# EAGLE design Key Matrix Scanner v3 (EAGLE 9.5.1)
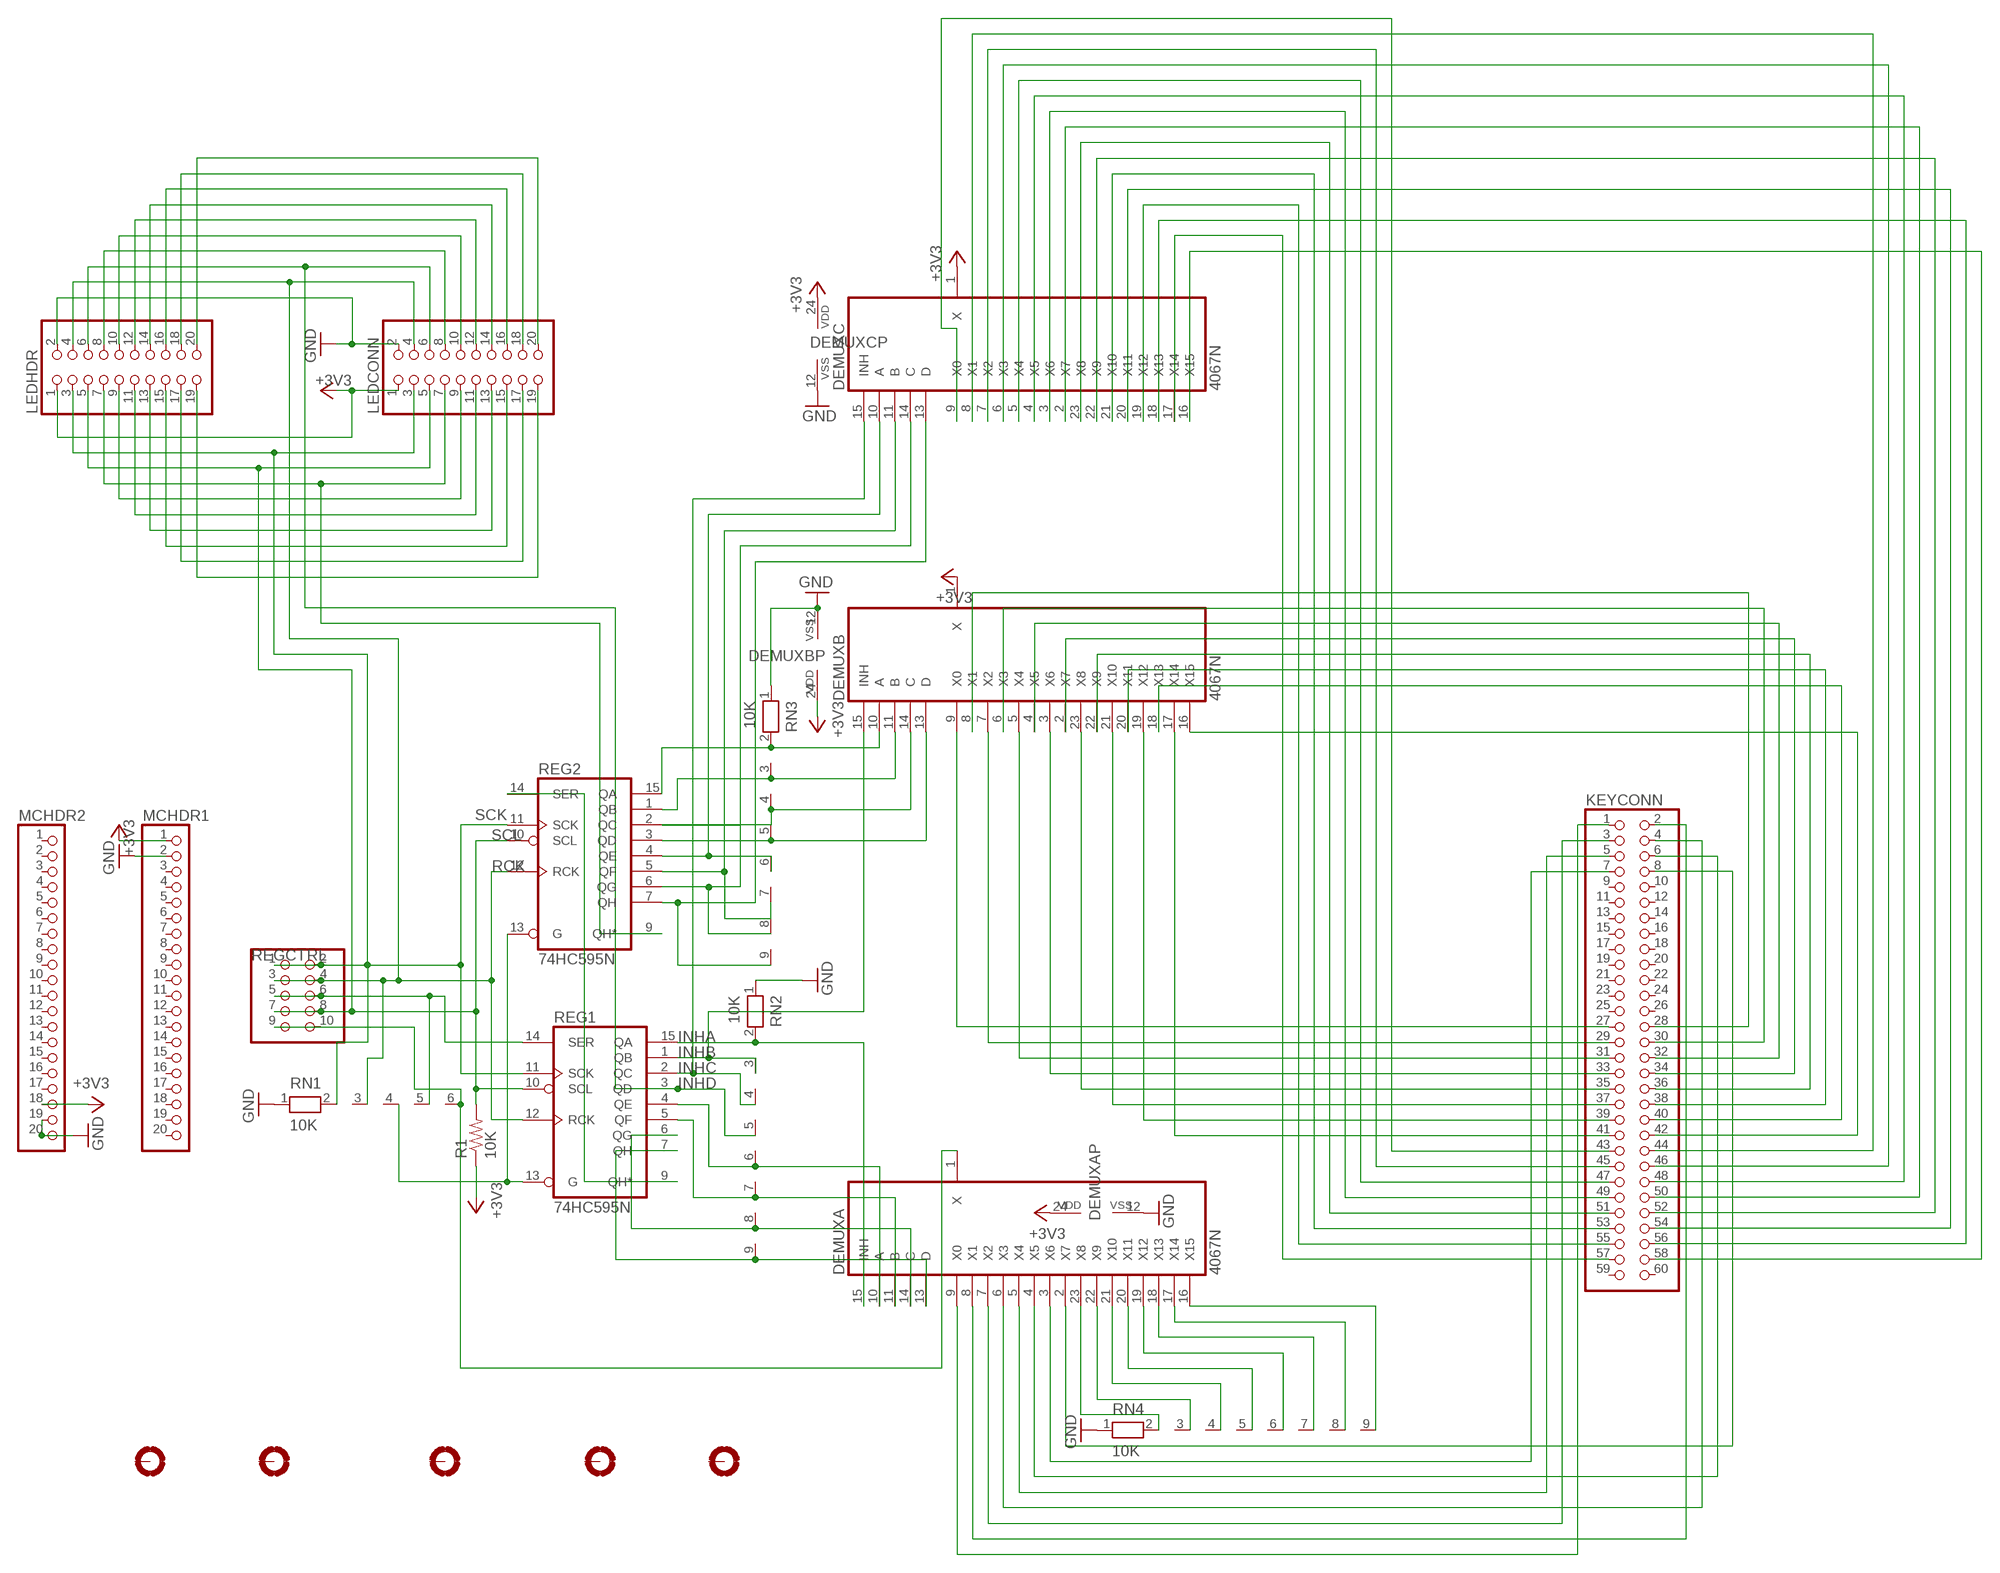
[diagram p0: schematic, sheet 1]

## Parts
DEMUXA  4067N  [DIL24-6]
DEMUXB  4067N  [DIL24-6]
DEMUXC  4067N  [DIL24-6]
H1  MOUNT-PAD-ROUND3.0  [3,0-PAD]
H2  MOUNT-PAD-ROUND3.0  [3,0-PAD]
H3  MOUNT-PAD-ROUND3.0  [3,0-PAD]
H4  MOUNT-PAD-ROUND3.0  [3,0-PAD]
H5  MOUNT-PAD-ROUND3.0  [3,0-PAD]
KEYCONN  PINHD-2X30/90  [2X30/90]
LEDCONN  PINHD-2X10  [2X10]
LEDHDR  PINHD-2X10  [2X10]
MCHDR1  PINHD-1X20  [1X20]
MCHDR2  PINHD-1X20  [1X20]
R1  10K  R-US_0204/7  [0204/7]
REG1  74HC595N  [DIL16]
REG2  74HC595N  [DIL16]
REGCTRL  PINHD-2X5  [2X05]
RN1  10K  RN05  [RN-6]
RN2  10K  RN08  [RN-9]
RN3  10K  RN08  [RN-9]
RN4  10K  RN08  [RN-9]

## Nets
+3V3: DEMUXA.24(VDD) DEMUXB.1(X) DEMUXB.24(VDD) DEMUXC.1(X) DEMUXC.24(VDD) LEDCONN.1 LEDHDR.1 MCHDR1.1 MCHDR2.18 R1.1
DATA: REG1.14(SER) REGCTRL.5 REGCTRL.6 RN1.5
GND: DEMUXA.12(VSS) DEMUXB.12(VSS) DEMUXC.12(VSS) LEDCONN.2 LEDHDR.2 MCHDR1.2 MCHDR2.19 MCHDR2.20 RN1.1 RN2.1 RN3.1 RN4.1
INHA: DEMUXA.15(INH) REG1.15(QA) RN2.2
INHB: DEMUXB.15(INH) REG1.1(QB) RN2.3
INHC: DEMUXC.15(INH) REG1.2(QC) RN2.4
INHD: LEDCONN.6 LEDHDR.6 REG1.3(QD) RN2.5
KEYREAD: DEMUXA.1(X) REGCTRL.9 REGCTRL.10 RN1.6
N$1: DEMUXC.13(D) REG2.7(QH) RN3.9
N$2: DEMUXA.9(X0) KEYCONN.1
N$3: REG1.9(QH*) REG2.14(SER)
N$4: LEDCONN.8 LEDHDR.8
N$5: LEDCONN.10 LEDHDR.10
N$6: LEDCONN.12 LEDHDR.12
N$7: LEDCONN.14 LEDHDR.14
N$8: LEDCONN.16 LEDHDR.16
N$9: LEDCONN.18 LEDHDR.18
N$10: LEDCONN.20 LEDHDR.20
N$11: DEMUXB.22(X9) KEYCONN.36
N$12: DEMUXA.8(X1) KEYCONN.2
N$13: DEMUXA.7(X2) KEYCONN.3
N$14: LEDCONN.9 LEDHDR.9
N$15: LEDCONN.11 LEDHDR.11
N$16: LEDCONN.13 LEDHDR.13
N$17: LEDCONN.15 LEDHDR.15
N$18: LEDCONN.17 LEDHDR.17
N$19: LEDCONN.19 LEDHDR.19
N$20: DEMUXC.14(C) REG2.6(QG) RN3.8
N$21: DEMUXC.11(B) REG2.5(QF) RN3.7
N$22: DEMUXC.10(A) REG2.4(QE) RN3.6
N$23: DEMUXA.6(X3) KEYCONN.4
N$24: DEMUXA.13(D) REG1.7(QH) RN2.9
N$25: DEMUXB.14(C) REG2.2(QC) RN3.4
N$26: DEMUXB.11(B) REG2.1(QB) RN3.3
N$27: DEMUXA.22(X9) RN4.3
N$28: DEMUXA.5(X4) KEYCONN.5
N$29: DEMUXA.10(A) REG1.4(QE) RN2.6
N$31: DEMUXA.21(X10) RN4.4
N$32: DEMUXA.20(X11) RN4.5
N$33: DEMUXA.4(X5) KEYCONN.6
N$34: DEMUXA.3(X6) KEYCONN.7
N$35: DEMUXA.2(X7) KEYCONN.8
N$36: DEMUXB.9(X0) KEYCONN.27
N$37: DEMUXB.8(X1) KEYCONN.28
N$38: DEMUXA.19(X12) RN4.6
N$39: DEMUXA.18(X13) RN4.7
N$40: DEMUXB.13(D) REG2.3(QD) RN3.5
N$41: DEMUXB.10(A) REG2.15(QA) RN3.2
N$42: DEMUXB.7(X2) KEYCONN.29
N$43: DEMUXB.6(X3) KEYCONN.30
N$44: DEMUXB.5(X4) KEYCONN.31
N$45: DEMUXB.4(X5) KEYCONN.32
N$46: DEMUXB.3(X6) KEYCONN.33
N$47: DEMUXB.2(X7) KEYCONN.34
N$48: DEMUXB.23(X8) KEYCONN.35
N$49: DEMUXA.14(C) REG1.6(QG) RN2.8
N$50: DEMUXB.21(X10) KEYCONN.37
N$51: DEMUXB.20(X11) KEYCONN.38
N$52: DEMUXB.19(X12) KEYCONN.39
N$53: DEMUXB.18(X13) KEYCONN.40
N$54: DEMUXB.17(X14) KEYCONN.41
N$55: DEMUXB.16(X15) KEYCONN.42
N$56: DEMUXC.9(X0) KEYCONN.43
N$57: DEMUXC.8(X1) KEYCONN.44
N$58: DEMUXC.7(X2) KEYCONN.45
N$59: DEMUXC.6(X3) KEYCONN.46
N$60: DEMUXC.5(X4) KEYCONN.47
N$61: DEMUXC.4(X5) KEYCONN.48
N$62: DEMUXC.3(X6) KEYCONN.49
N$63: DEMUXC.2(X7) KEYCONN.50
N$64: DEMUXC.23(X8) KEYCONN.51
N$65: DEMUXC.22(X9) KEYCONN.52
N$66: DEMUXC.20(X11) KEYCONN.54
N$67: DEMUXC.21(X10) KEYCONN.53
N$68: DEMUXC.19(X12) KEYCONN.55
N$69: DEMUXC.18(X13) KEYCONN.56
N$70: DEMUXC.17(X14) KEYCONN.57
N$71: DEMUXC.16(X15) KEYCONN.58
N$72: DEMUXA.17(X14) RN4.8
N$73: DEMUXA.16(X15) RN4.9
N$76: DEMUXA.11(B) REG1.5(QF) RN2.7
N$77: REG1.13(G) REG2.13(G) RN1.4
N$78: DEMUXA.23(X8) RN4.2
RCK: LEDCONN.4 LEDHDR.4 REG1.12(RCK) REG2.12(RCK) REGCTRL.3 REGCTRL.4 RN1.3
REG3DATA: LEDCONN.7 LEDHDR.7 REG2.9(QH*)
SCK: LEDCONN.3 LEDHDR.3 REG1.11(SCK) REG2.11(SCK) REGCTRL.1 REGCTRL.2 RN1.2
SCL: LEDCONN.5 LEDHDR.5 R1.2 REG1.10(SCL) REG2.10(SCL) REGCTRL.7 REGCTRL.8
Unconnected: H1.B3,0(MOUNT) H2.B3,0(MOUNT) H3.B3,0(MOUNT) H4.B3,0(MOUNT) H5.B3,0(MOUNT) KEYCONN.9 KEYCONN.10 KEYCONN.11 KEYCONN.12 KEYCONN.13 KEYCONN.14 KEYCONN.15 KEYCONN.16 KEYCONN.17 KEYCONN.18 KEYCONN.19 KEYCONN.20 KEYCONN.21 KEYCONN.22 KEYCONN.23 KEYCONN.24 KEYCONN.25 KEYCONN.26 KEYCONN.59 KEYCONN.60 MCHDR1.3 MCHDR1.4 MCHDR1.5 MCHDR1.6 MCHDR1.7 MCHDR1.8 MCHDR1.9 MCHDR1.10 MCHDR1.11 MCHDR1.12 MCHDR1.13 MCHDR1.14 MCHDR1.15 MCHDR1.16 MCHDR1.17 MCHDR1.18 MCHDR1.19 MCHDR1.20 MCHDR2.1 MCHDR2.2 MCHDR2.3 MCHDR2.4 MCHDR2.5 MCHDR2.6 MCHDR2.7 MCHDR2.8 MCHDR2.9 MCHDR2.10 MCHDR2.11 MCHDR2.12 MCHDR2.13 MCHDR2.14 MCHDR2.15 MCHDR2.16 MCHDR2.17

## Power pins joined to a net without a drawn wire
+3V3: REG1.16(VCC) REG2.16(VCC)
GND: REG1.8(GND) REG2.8(GND)

## Library data of the parts
DEMUXA DEMUXB DEMUXC = 40xx:4067: 16-channel ANALOG MULTIPLEXER
H1-H5 = holes:MOUNT-PAD-ROUND: MOUNTING PAD, round
KEYCONN = pinhead:PINHD-2X30: PIN HEADER
LEDCONN LEDHDR = pinhead:PINHD-2X10: PIN HEADER
MCHDR1 MCHDR2 = pinhead:PINHD-1X20: PIN HEADER
R1 = resistor:R-US_: RESISTOR, American symbol
REG1 REG2 = 74xx-eu:74*595: 8-bit SHIFT REGISTER, output latch
REGCTRL = pinhead:PINHD-2X5: PIN HEADER
RN1 = resistor-net:RN05: RESISTOR NETWORK; OC_FARNELL: unknown; OC_NEWARK: unknown
RN2-RN4 = resistor-net:RN08: RESISTOR NETWORK; OC_FARNELL: unknown; OC_NEWARK: unknown

## Board
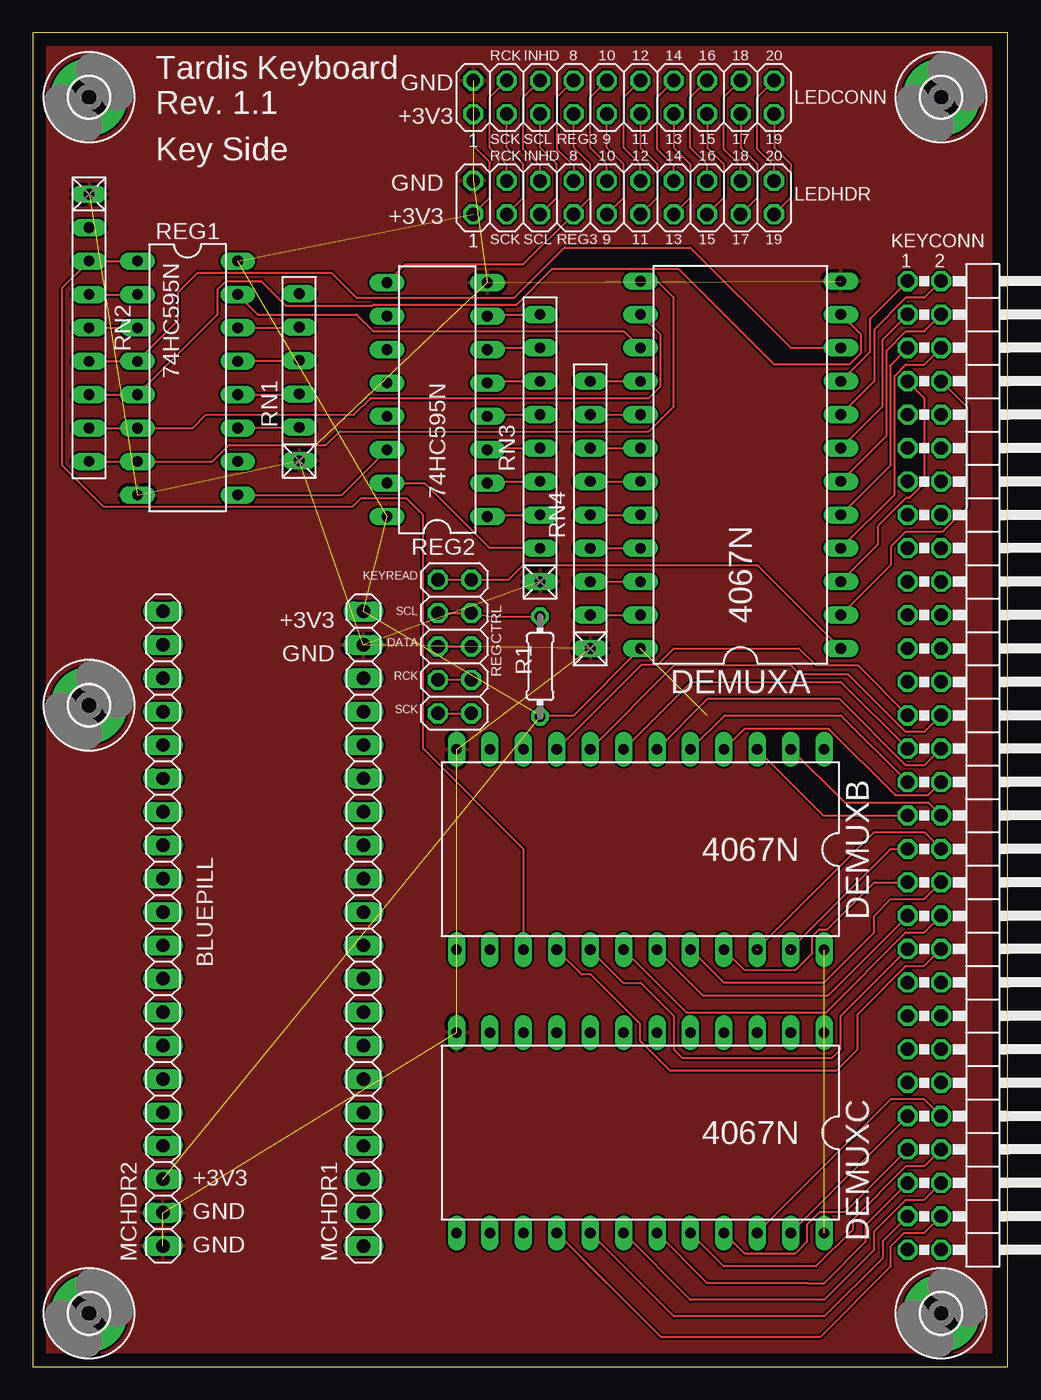
[diagram p1: board, top side]
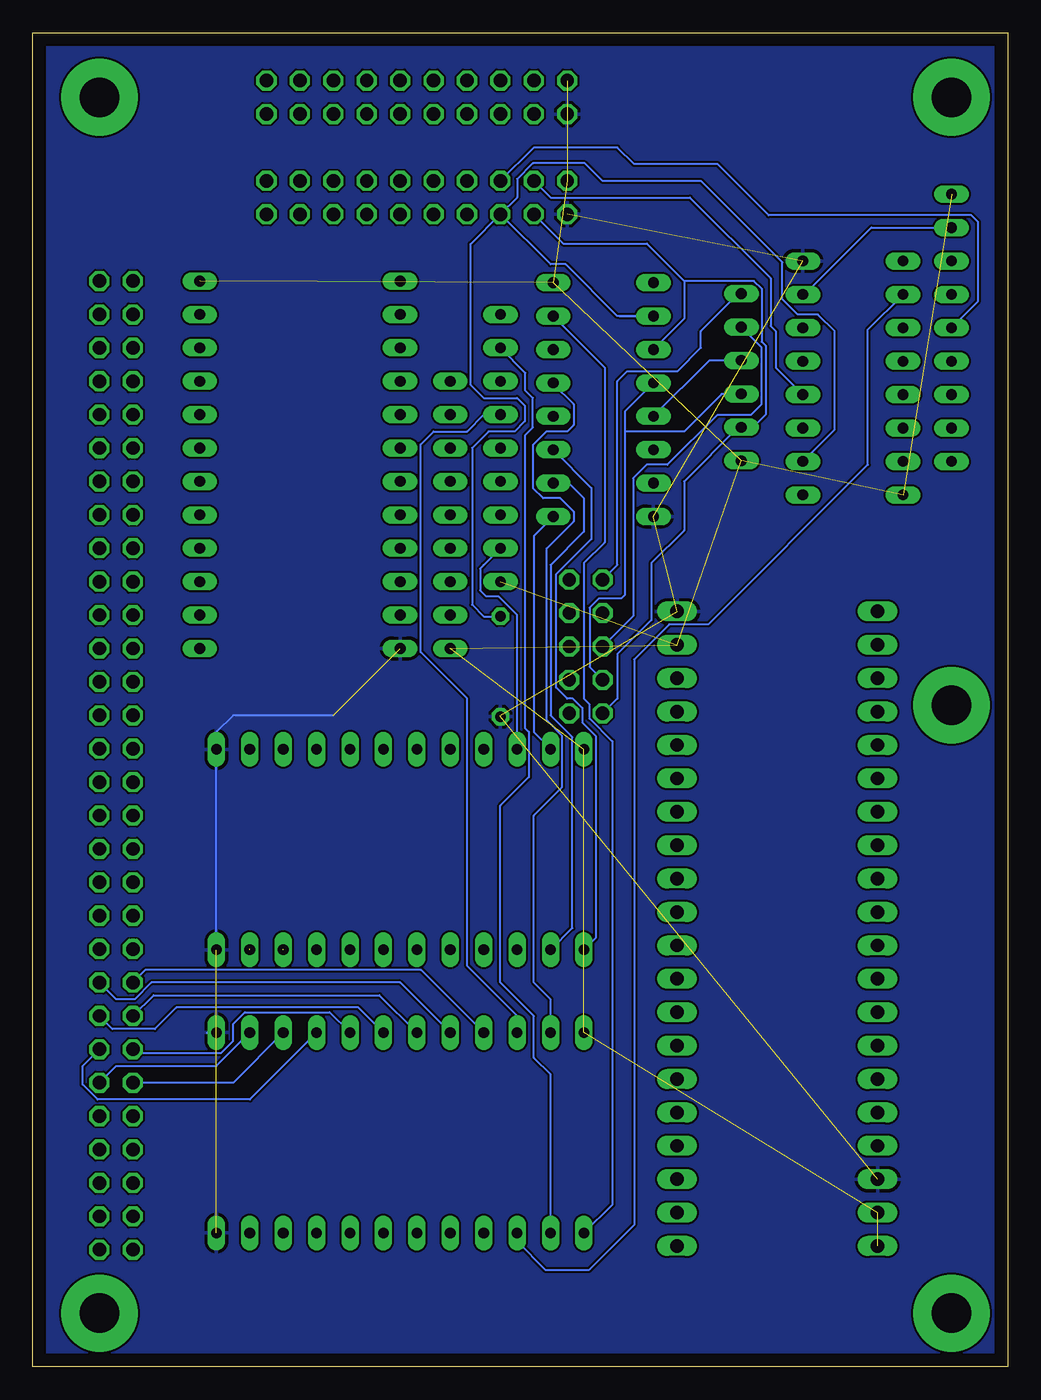
[diagram p2: board, bottom side, seen from below]

Size 74.1 x 101.42 mm. Coordinates in mm from the lower left corner, seen from the top.
Outline: 0,0 74.1,0 74.1,101.42 0,101.42 0,0
Copper layers (1*16): Top 0.035mm / dielectric 1.5mm / Bottom 0.035mm
Design rules "default": minimum track width 6mil, minimum drill 0.35mm, track to track 6mil, track to pad 6mil, pad to pad 6mil, via to via 6mil, smd to smd 6mil, copper to edge 40mil, drill to drill 6mil, minimum pad ring 10mil, minimum via ring 8mil, stop-mask expansion 4mil, vias tented up to drill 0mil, thermal gap 10mil

### Footprints (pad centres in the part's own frame; a part is rotated, then mirrored left to right if it is on the bottom)
DIL24-6 = drill 0.813 long: 1 -13.97,-7.62; 2 -11.43,-7.62; 3 -8.89,-7.62; 4 -6.35,-7.62; 5 -3.81,-7.62; 6 -1.27,-7.62; 7 1.27,-7.62; 8 3.81,-7.62; 9 6.35,-7.62; 10 8.89,-7.62; 11 11.43,-7.62; 12 13.97,-7.62; 13 13.97,7.62; 14 11.43,7.62; 15 8.89,7.62; 16 6.35,7.62; 17 3.81,7.62; 18 1.27,7.62; 19 -1.27,7.62; 20 -3.81,7.62; 21 -6.35,7.62; 22 -8.89,7.62; 23 -11.43,7.62; 24 -13.97,7.62
3,0-PAD = drill 3 pad 5.842: B3,0 0,0
2X30/90 = drill 1.016 octagon: 1 -36.83,-6.35; 2 -36.83,-3.81; 3 -34.29,-6.35; 4 -34.29,-3.81; 5 -31.75,-6.35; 6 -31.75,-3.81; 7 -29.21,-6.35; 8 -29.21,-3.81; 9 -26.67,-6.35; 10 -26.67,-3.81; 11 -24.13,-6.35; 12 -24.13,-3.81; 13 -21.59,-6.35; 14 -21.59,-3.81; 15 -19.05,-6.35; 16 -19.05,-3.81; 17 -16.51,-6.35; 18 -16.51,-3.81; 19 -13.97,-6.35; 20 -13.97,-3.81; 21 -11.43,-6.35; 22 -11.43,-3.81; 23 -8.89,-6.35; 24 -8.89,-3.81; 25 -6.35,-6.35; 26 -6.35,-3.81; 27 -3.81,-6.35; 28 -3.81,-3.81; 29 -1.27,-6.35; 30 -1.27,-3.81; 31 1.27,-6.35; 32 1.27,-3.81; 33 3.81,-6.35; 34 3.81,-3.81; 35 6.35,-6.35; 36 6.35,-3.81; 37 8.89,-6.35; 38 8.89,-3.81; 39 11.43,-6.35; 40 11.43,-3.81; 41 13.97,-6.35; 42 13.97,-3.81; 43 16.51,-6.35; 44 16.51,-3.81; 45 19.05,-6.35; 46 19.05,-3.81; 47 21.59,-6.35; 48 21.59,-3.81; 49 24.13,-6.35; 50 24.13,-3.81; 51 26.67,-6.35; 52 26.67,-3.81; 53 29.21,-6.35; 54 29.21,-3.81; 55 31.75,-6.35; 56 31.75,-3.81; 57 34.29,-6.35; 58 34.29,-3.81; 59 36.83,-6.35; 60 36.83,-3.81
2X10 = drill 1.016 octagon: 1 -11.43,-1.27; 2 -11.43,1.27; 3 -8.89,-1.27; 4 -8.89,1.27; 5 -6.35,-1.27; 6 -6.35,1.27; 7 -3.81,-1.27; 8 -3.81,1.27; 9 -1.27,-1.27; 10 -1.27,1.27; 11 1.27,-1.27; 12 1.27,1.27; 13 3.81,-1.27; 14 3.81,1.27; 15 6.35,-1.27; 16 6.35,1.27; 17 8.89,-1.27; 18 8.89,1.27; 19 11.43,-1.27; 20 11.43,1.27
1X20 = drill 1.016 long: 1 -24.13,0; 2 -21.59,0; 3 -19.05,0; 4 -16.51,0; 5 -13.97,0; 6 -11.43,0; 7 -8.89,0; 8 -6.35,0; 9 -3.81,0; 10 -1.27,0; 11 1.27,0; 12 3.81,0; 13 6.35,0; 14 8.89,0; 15 11.43,0; 16 13.97,0; 17 16.51,0; 18 19.05,0; 19 21.59,0; 20 24.13,0
0204/7 = drill 0.813 octagon: 1 -3.81,0; 2 3.81,0
DIL16 = drill 0.813 long: 1 -8.89,-3.81; 2 -6.35,-3.81; 3 -3.81,-3.81; 4 -1.27,-3.81; 5 1.27,-3.81; 6 3.81,-3.81; 7 6.35,-3.81; 8 8.89,-3.81; 9 8.89,3.81; 10 6.35,3.81; 11 3.81,3.81; 12 1.27,3.81; 13 -1.27,3.81; 14 -3.81,3.81; 15 -6.35,3.81; 16 -8.89,3.81
2X05 = drill 1.016 octagon: 1 -5.08,-1.27; 2 -5.08,1.27; 3 -2.54,-1.27; 4 -2.54,1.27; 5 0,-1.27; 6 0,1.27; 7 2.54,-1.27; 8 2.54,1.27; 9 5.08,-1.27; 10 5.08,1.27
RN-6 = drill 0.813 long: 1 -6.35,0; 2 -3.81,0; 3 -1.27,0; 4 1.27,0; 5 3.81,0; 6 6.35,0
RN-9 = drill 0.813 long: 1 -10.16,0; 2 -7.62,0; 3 -5.08,0; 4 -2.54,0; 5 0,0; 6 2.54,0; 7 5.08,0; 8 7.62,0; 9 10.16,0

### Placement (x,y rotation side)
DEMUXA  53.8,68.58 90 top
DEMUXB  46.18,39.32 180 top
DEMUXC  46.18,17.78 180 top
H1  4.27,4.06 0 top
H2  4.27,50.29 0 top
H3  4.27,96.52 0 top
H4  69.04,96.52 0 top
H5  69.04,4.06 0 top
KEYCONN  72.85,45.72 270 top
LEDCONN  44.91,96.52 0 top
LEDHDR  44.91,88.9 0 top
MCHDR1  25.12,33.3 270 top
MCHDR2  9.88,33.3 270 top
R1  38.56,53.24 90 top
REG1  11.76,75.18 270 top
REG2  30.73,73.53 90 top
REGCTRL  32.05,54.76 90 top
RN1  20.24,75.24 90 top
RN2  4.27,78.99 270 top
RN3  38.56,69.85 90 top
RN4  42.37,64.77 90 top

### Tracks (layer width: path | path; a pad name or v marks a point on that pad's centre or on a via)
+3V3  (8 unrouted)
  Top 0.152: LEDCONN.1 33.48,92.84 34.75,91.57 34.75,88.9 LEDHDR.1 | R1.1 38.61,49.48 | 38.61,49.48 38.66,49.53 41.1,49.53 DEMUXA.24 | 38.56,49.53 38.61,49.48
  Bottom 0.152: DEMUXB.24 DEMUXB.1 60.15,48.26 58.88,49.53 51.26,49.53 | DEMUXC.1 60.86,25.4 60.88,25.38
  pour Bottom: 0.46,101.6 75.39,101.6 75.39,0 0.46,0
DATA
  Top 0.152: REG1.14 18.24,78.99 | 18.24,78.99 20.24,78.99 RN1.5 | REGCTRL.6 REGCTRL.5 | 18.24,78.99
  Bottom 0.152: REGCTRL.6 28.47,57.07 28.47,67.55 27.44,68.58 25.86,68.58 22.05,72.39 19.51,72.39 18.69,73.2 18.69,77.5 RN1.5
GND  (13 unrouted)
  pour Top: 0.44,101.6 72.85,101.6 72.85,0 0.44,0
INHA
  Top 0.152: DEMUXA.15 44.91,78.74 25.86,78.74 24.59,80.01 17.09,80.01 REG1.15
  Bottom 0.152: REG1.15 15.44,81.53 10.36,86.61 RN2.2
INHB
  Top 0.152: DEMUXB.15 37.29,39.37 29.67,46.99 29.67,64.77 28.4,66.04 24.94,66.04 24.31,65.41 5.35,65.41 2.24,68.52 2.24,82.04 RN2.3 REG1.1
INHC
  Top 0.152: RN2.4 REG1.2
  Bottom 0.152: REG1.2 10.62,78.87 10.62,68.58 22.76,56.44 25.73,56.44 28.4,53.78 28.4,10.78 31.84,7.34 35.12,7.34 37.29,9.51 DEMUXC.15
INHD
  Top 0.152: LEDHDR.6 38.56,91.31 37.29,92.58 37.29,96.52 LEDCONN.6 | RN2.5 REG1.3
  Bottom 0.152: LEDHDR.6 36.02,92.71 29.67,92.71 28.4,91.44 22.05,91.44 18.16,87.55 2.76,87.55 2.24,87.03 2.24,81.03 RN2.5
KEYREAD
  Top 0.152: REGCTRL.10 REGCTRL.9 36.17,59.84 37.29,60.96 55.07,60.96 DEMUXA.1
  Bottom 0.152: RN1.6 20.47,81.59 23.32,78.74 23.32,77.47 25.1,75.69 28.91,75.69 29.67,74.93 29.67,60.96 REGCTRL.10
N$1
  Top 0.152: REG2.7 34.67,80.01 RN3.9
  Bottom 0.152: DEMUXC.13 30.05,12.32 30.05,47.55 31.78,49.27 31.78,50.37 32.21,50.8 32.21,61.09 30.63,62.67 30.63,75.97 REG2.7
N$2
  Top 0.152: DEMUXA.9 63.65,77.16 63.65,79.7 KEYCONN.1
N$3
  Top 0.152: REG1.9 23.5,66.29 REG2.14
N$4
  Top 0.152: LEDCONN.8 39.83,96.52 39.83,92.58 41.1,91.31 LEDHDR.8
N$5
  Top 0.152: LEDCONN.10 42.37,96.52 42.37,92.71 43.64,91.44 LEDHDR.10
N$6
  Top 0.152: LEDCONN.12 44.91,96.52 44.91,92.71 46.18,91.44 LEDHDR.12
N$7
  Top 0.152: LEDCONN.14 47.45,96.52 47.45,92.58 48.72,91.31 LEDHDR.14
N$8
  Top 0.152: LEDCONN.16 49.99,96.52 49.99,92.71 51.26,91.44 LEDHDR.16
N$9
  Top 0.152: LEDCONN.18 52.53,96.52 52.53,92.58 53.8,91.31 LEDHDR.18
N$10
  Top 0.152: LEDCONN.20 55.07,96.52 55.07,92.58 56.34,91.31 LEDHDR.20
N$11  (1 unrouted)
  Top 0.152: KEYCONN.36 67.77,40.64 63.96,40.64 55.07,31.75
N$12
  Top 0.152: DEMUXA.8 63.96,74.93 63.96,78.87 66.37,81.28 67.77,81.28 KEYCONN.2
N$13
  Top 0.152: KEYCONN.3 64.59,78.1 64.59,73.02 DEMUXA.7
N$14
  Top 0.152: LEDHDR.9 44.91,88.9 44.91,91.44 43.64,92.71 LEDCONN.9
N$15
  Top 0.152: LEDCONN.11 46.18,92.71 47.45,91.44 47.45,88.9 LEDHDR.11
N$16
  Top 0.152: LEDCONN.13 48.72,92.71 49.99,91.44 49.99,88.9 LEDHDR.13
N$17
  Top 0.152: LEDCONN.15 51.26,92.71 52.53,91.44 52.53,88.9 LEDHDR.15
N$18
  Top 0.152: LEDCONN.17 53.8,92.71 55.07,91.44 55.07,88.9 LEDHDR.17
N$19
  Top 0.152: LEDCONN.19 56.34,92.71 57.61,91.44 57.61,88.9 LEDHDR.19
N$20
  Top 0.152: REG2.6 34.67,77.47 RN3.8
  Bottom 0.152: DEMUXC.14 34.75,22.21 36.02,23.48 36.02,26.67 38.56,29.21 38.56,42.67 36.4,44.83 36.4,48.26 36.7,48.57 36.7,70.81 36.09,71.42 36.09,73.66 36.65,74.22 36.65,75.56 RN3.8
N$21
  Top 0.152: REG2.5 34.67,74.93 RN3.7
  Bottom 0.152: DEMUXC.11 34.75,27.94 36.02,29.21 36.02,41.91 33.86,44.07 33.86,47.97 35.05,49.16 35.05,62.22 32.99,64.27 32.99,65.01 34.02,66.04 35.32,66.04 36.09,66.81 36.09,70.09 35.06,71.12 33.48,71.12 32.99,71.6 32.99,73.18 34.54,74.73 REG2.5
N$22
  Top 0.152: REG2.4 34.67,72.39 RN3.6
  Bottom 0.152: DEMUXC.10 37.29,26.67 41.1,30.48 41.1,50.8 44.63,54.33 44.63,70.13 43.64,71.12 41.1,71.12 39.83,72.39 RN3.6
N$23
  Top 0.152: KEYCONN.4 67.77,78.74 66.37,78.74 64.9,77.27 64.9,70.79 DEMUXA.6
N$24
  Top 0.152: DEMUXA.13 47.45,82.55 48.72,81.28 48.72,73.01 46.83,71.12 23.32,71.12 22.28,70.08 14.9,70.08 13.65,68.83 REG1.7 RN2.9
N$25
  Top 0.152: REG2.2 34.67,67.31 RN3.4
  Bottom 0.152: DEMUXB.14 33.1,33.35 33.1,47.88 34.75,49.53 34.75,60.96 32.21,63.5 32.21,66.04 33.35,67.18 REG2.2
N$26
  Top 0.152: REG2.1 34.67,64.77 RN3.3
  Bottom 0.152: DEMUXB.11 34.75,46.99 36.02,48.26 36.02,63.17 REG2.1
N$27
  Top 0.152: RN4.3 DEMUXA.22
N$28
  Top 0.152: DEMUXA.5 65.2,68.55 65.2,76.17 KEYCONN.5
N$29
  Top 0.152: DEMUXA.10 57.61,77.47 49.99,85.09 40.4,85.09 36.59,81.28 24.59,81.28 22.68,83.18 12.52,83.18 11.06,81.72 11.06,79.57 REG1.4 RN2.6
N$31
  Top 0.152: RN4.4 DEMUXA.21
N$32
  Top 0.152: RN4.5 DEMUXA.20
N$33
  Top 0.152: DEMUXA.4 65.51,66.32 65.51,75.34 66.37,76.2 67.77,76.2 KEYCONN.6
N$34
  Top 0.152: KEYCONN.7 67.77,73.66 67.77,67.18 66.63,66.04 66.37,66.04 64.24,63.91 64.24,62.51 DEMUXA.3
N$35
  Top 0.152: DEMUXA.2 65.23,60.96 65.23,62.36 66.37,63.5 69.17,63.5 71.01,65.34 71.01,72.96 KEYCONN.8
N$36
  Top 0.152: DEMUXB.9 46.23,53.34 47.45,53.34 48.72,54.61 58.23,54.61 59.5,53.34 62.69,53.34 KEYCONN.27
N$37
  Top 0.152: KEYCONN.28 67.77,48.26 66.37,48.26 61.99,52.64 58.31,52.64 57.61,53.34 48.77,53.34 DEMUXB.8
N$38
  Top 0.152: RN4.6 DEMUXA.19
N$39
  Top 0.152: RN4.7 DEMUXA.18
N$40
  Top 0.152: REG2.3 34.67,69.85 RN3.5
  Bottom 0.152: DEMUXB.13 31.32,32.59 31.32,47.97 32.33,48.98 32.33,50.09 33.04,50.8 33.48,50.8 34.32,51.64 34.32,60.25 31.64,62.93 31.64,66.82 REG2.3
N$41
  Top 0.152: REG2.15 29.79,67.18 34.75,62.23 RN3.2
  Bottom 0.152: RN3.2 39.83,60.96 40.11,60.68 40.11,59.03 39.66,58.59 38.72,58.59 37.29,57.15 DEMUXB.10
N$42
  Top 0.152: DEMUXB.7 50.04,52.07 61.42,52.07 KEYCONN.29
N$43
  Top 0.152: KEYCONN.30 67.77,45.72 66.37,45.72 61.29,50.8 51.31,50.8 DEMUXB.6
N$44
  Top 0.152: DEMUXB.5 52.58,49.53 61.42,49.53 KEYCONN.31
N$45
  Top 0.152: DEMUXB.4 54.08,48.49 60.52,48.49 65.54,43.46 68.05,43.46 KEYCONN.32
N$46
  Top 0.152: DEMUXB.3 60.1,41.91 KEYCONN.33
N$47
  Top 0.152: DEMUXB.2 57.66,46.94 61.7,42.9 68.05,42.9 KEYCONN.34
N$48  (1 unrouted)
  Top 0.152: 57.61,31.75 65.23,39.37 KEYCONN.35
N$49
  Top 0.152: DEMUXA.14 47.73,78.46 47.73,74.56 46.83,73.66 25.66,73.66 24.39,72.39 13.16,72.39 12.14,71.37 REG1.6 RN2.8
N$50
  Top 0.152: DEMUXB.21 54.08,30.15 57.98,30.15 59.26,31.43 59.26,32.73 59.78,33.25 60.38,33.25 63.96,36.83 KEYCONN.37
N$51
  Top 0.152: KEYCONN.38 67.77,35.56 66.5,35.56 65.93,35.56 65.23,35.56 63.96,34.29 63.96,33.02 60.15,29.21 52.53,29.21 50.04,31.7 DEMUXB.20
N$52
  Top 0.152: DEMUXB.19 50.9,28.24 60.45,28.24 KEYCONN.39
N$53
  Top 0.152: KEYCONN.40 67.77,33.02 66.37,33.02 60.3,26.95 49.66,26.95 DEMUXB.18
N$54
  Top 0.152: DEMUXB.17 44.88,29.19 46.2,29.19 48.72,26.67 48.72,24.13 49.35,23.49 60.78,23.49 61.42,24.13 61.42,26.67 KEYCONN.41
N$55
  Top 0.152: KEYCONN.42 67.77,30.48 66.37,30.48 62.69,26.8 62.69,24.13 61.09,22.54 48.39,22.54 46.18,24.75 46.18,26.05 42.41,29.82 41.71,29.82 DEMUXB.16
N$56
  Bottom 0.152: DEMUXC.9 44.58,30.15 65.56,30.15 KEYCONN.43
N$57
  Bottom 0.152: KEYCONN.44 67.77,27.94 66.37,27.94 65.1,29.21 46.18,29.21 DEMUXC.8
N$58
  Bottom 0.152: DEMUXC.7 47.75,28.24 64.92,28.24 KEYCONN.45
N$59
  Bottom 0.152: KEYCONN.46 68.05,25.68 64.82,25.68 63.19,27.3 49.35,27.3 DEMUXC.6
N$60
  Bottom 0.152: KEYCONN.47 66.22,23.85 59.78,23.85 58.88,24.75 58.88,26.05 57.98,26.95 51.54,26.95 DEMUXC.5
N$61
  Bottom 0.152: DEMUXC.4 57.61,20.32 69.17,20.32 70.31,21.46 70.31,22.86 KEYCONN.48
N$62
  Bottom 0.152: DEMUXC.3 58.88,21.59 KEYCONN.49
N$63
  Bottom 0.152: DEMUXC.2 60.15,22.86 60.17,22.84 67.79,22.84 KEYCONN.50
N$64
  Top 0.152: DEMUXC.23 KEYCONN.51
N$65
  Top 0.152: KEYCONN.52 67.77,20.32 65.23,20.32 DEMUXC.22
N$66
  Top 0.152: KEYCONN.54 67.77,15.24 66.37,15.24 62.31,11.18 62.31,10.4 59.53,7.62 52.53,7.62 DEMUXC.20
N$67
  Top 0.152: DEMUXC.21 54.08,8.61 57.98,8.61 58.88,9.51 58.88,10.81 59.82,11.75 61.74,11.75 KEYCONN.53
N$68
  Top 0.152: DEMUXC.19 51.26,6.35 58.88,6.35 60.15,6.35 63.32,9.52 63.32,10.79 KEYCONN.55
N$69
  Top 0.152: KEYCONN.56 67.77,12.7 66.37,12.7 63.96,10.29 63.96,8.89 60.15,5.08 49.99,5.08 DEMUXC.18
N$70
  Top 0.152: DEMUXC.17 48.72,3.81 60.15,3.81 64.59,8.25 64.59,9.52 KEYCONN.57
N$71
  Top 0.152: 43.64,6.35 DEMUXC.16 47.75,2.23 59.84,2.23 65.23,7.62 65.23,9.16 66.23,10.16 67.77,10.16 KEYCONN.58
N$72
  Top 0.152: RN4.8 DEMUXA.17
N$73
  Top 0.152: RN4.9 DEMUXA.16
N$76
  Top 0.152: DEMUXA.11 62.97,78.46 62.97,77.1 62.07,76.2 56.34,76.2 49.1,83.44 39.45,83.44 36.78,80.77 25.9,80.77 25.82,80.7 19.22,80.7 17.36,82.55 14.67,82.55 14.02,81.9 14.02,80.01 14.02,79.98 REG1.5 RN2.7
N$77
  Top 0.152: RN1.4 20.24,76.45 REG1.13
  Bottom 0.152: RN1.4 22.68,76.51 REG2.13
N$78
  Top 0.152: RN4.2 DEMUXA.23
RCK
  Top 0.152: REG1.12 20.24,73.91 RN1.3 | LEDHDR.4 36.02,91.44 34.75,92.71 34.75,96.52 LEDCONN.4 | REGCTRL.3 REGCTRL.4
  Bottom 0.152: REGCTRL.4 31.78,53.21 31.78,57.71 31.07,58.42 29.36,58.42 29.07,58.71 29.07,71.12 | RN1.3 21.74,73.97 24.59,71.12 29.07,71.12 | REG1.12 17.63,75.97 17.63,78.74 18.02,79.13 18.02,82.77 24.16,88.9 34.75,88.9 LEDHDR.4 | REG2.12 29.07,72.66 29.07,71.12
REG3DATA
  Top 0.152: LEDCONN.7 41.1,92.71 42.37,91.44 42.37,88.9 LEDHDR.7 37.29,83.82 28.32,83.82 REG2.9
SCK
  Top 0.152: RN1.2 20.24,71.37 REG1.11 | LEDHDR.3 37.29,88.9 37.29,91.44 36.02,92.71 LEDCONN.3 | REGCTRL.2 REGCTRL.1
  Bottom 0.152: 24.59,82.55 24.59,79.68 REG2.11 | REGCTRL.2 29.67,50.8 29.67,54.18 27.08,56.77 27.08,61.09 24.59,63.58 24.59,67.31 20.47,71.43 RN1.2 19.35,71.43 18.39,72.39 18.39,77.62 18.69,77.93 18.69,81.96 19.29,82.55 24.59,82.55 | 24.59,82.55 27.43,85.39 33.78,85.39 LEDHDR.3
SCL
  Top 0.152: REGCTRL.8 REGCTRL.7 34.85,57.05 R1.2 | LEDHDR.5 39.83,88.9 39.83,91.44 38.56,92.71 LEDCONN.5
  Bottom 0.152: 29.54,79.88 REG2.10 29.67,79.88 33.6,83.82 34.75,83.82 LEDHDR.5 | REG1.10 13.16,71.25 13.16,78.74 14.43,80.01 15.96,80.01 17.12,81.17 17.12,83.97 23.32,90.17 30.81,90.17 32.14,91.5 36.08,91.5 37.29,90.3 37.29,88.9 LEDHDR.5 | R1.2 39.83,57.05 40.72,57.94 40.72,69.85 39.45,71.12 37.48,71.12 36.7,71.89 36.7,73.08 37.29,73.66 39.83,73.66 40.82,74.65 40.82,85.37 LEDHDR.5

### Text on the board
tNames: Tardis Keyboard / Rev. 1.1 | RCK | INHD | 8 | 10 | 12 | 14 | 16 | 18 | 20 | GND | +3V3 | Key Side | SCK | SCL | REG3 | 9 | 11 | 13 | 15 | 17 | 19 | 1 | RCK | INHD | 8 | 10 | 12 | 14 | 16 | 18 | 20 | GND | +3V3 | 1 | SCK | SCL | REG3 | 9 | 11 | 13 | 15 | 17 | 19 | 1 | 2 | KEYREAD | +3V3 | SCL | GND | DATA | RCK | SCK | BLUEPILL | +3V3 | GND | GND